# Altium schematic sheet 3_MCU.schdoc
size 711 x 327 mm; Name: A_A3; Symbol: A_A3; Device: A_A3; @Project Name: DM lite opensource board A2A V1.0; REV: 1.0; Date: 2022-03-15; Sheet: 1/1; Draw By: l87732382; Company: Your Company; Convert to PCB: yes; Add into BOM: yes
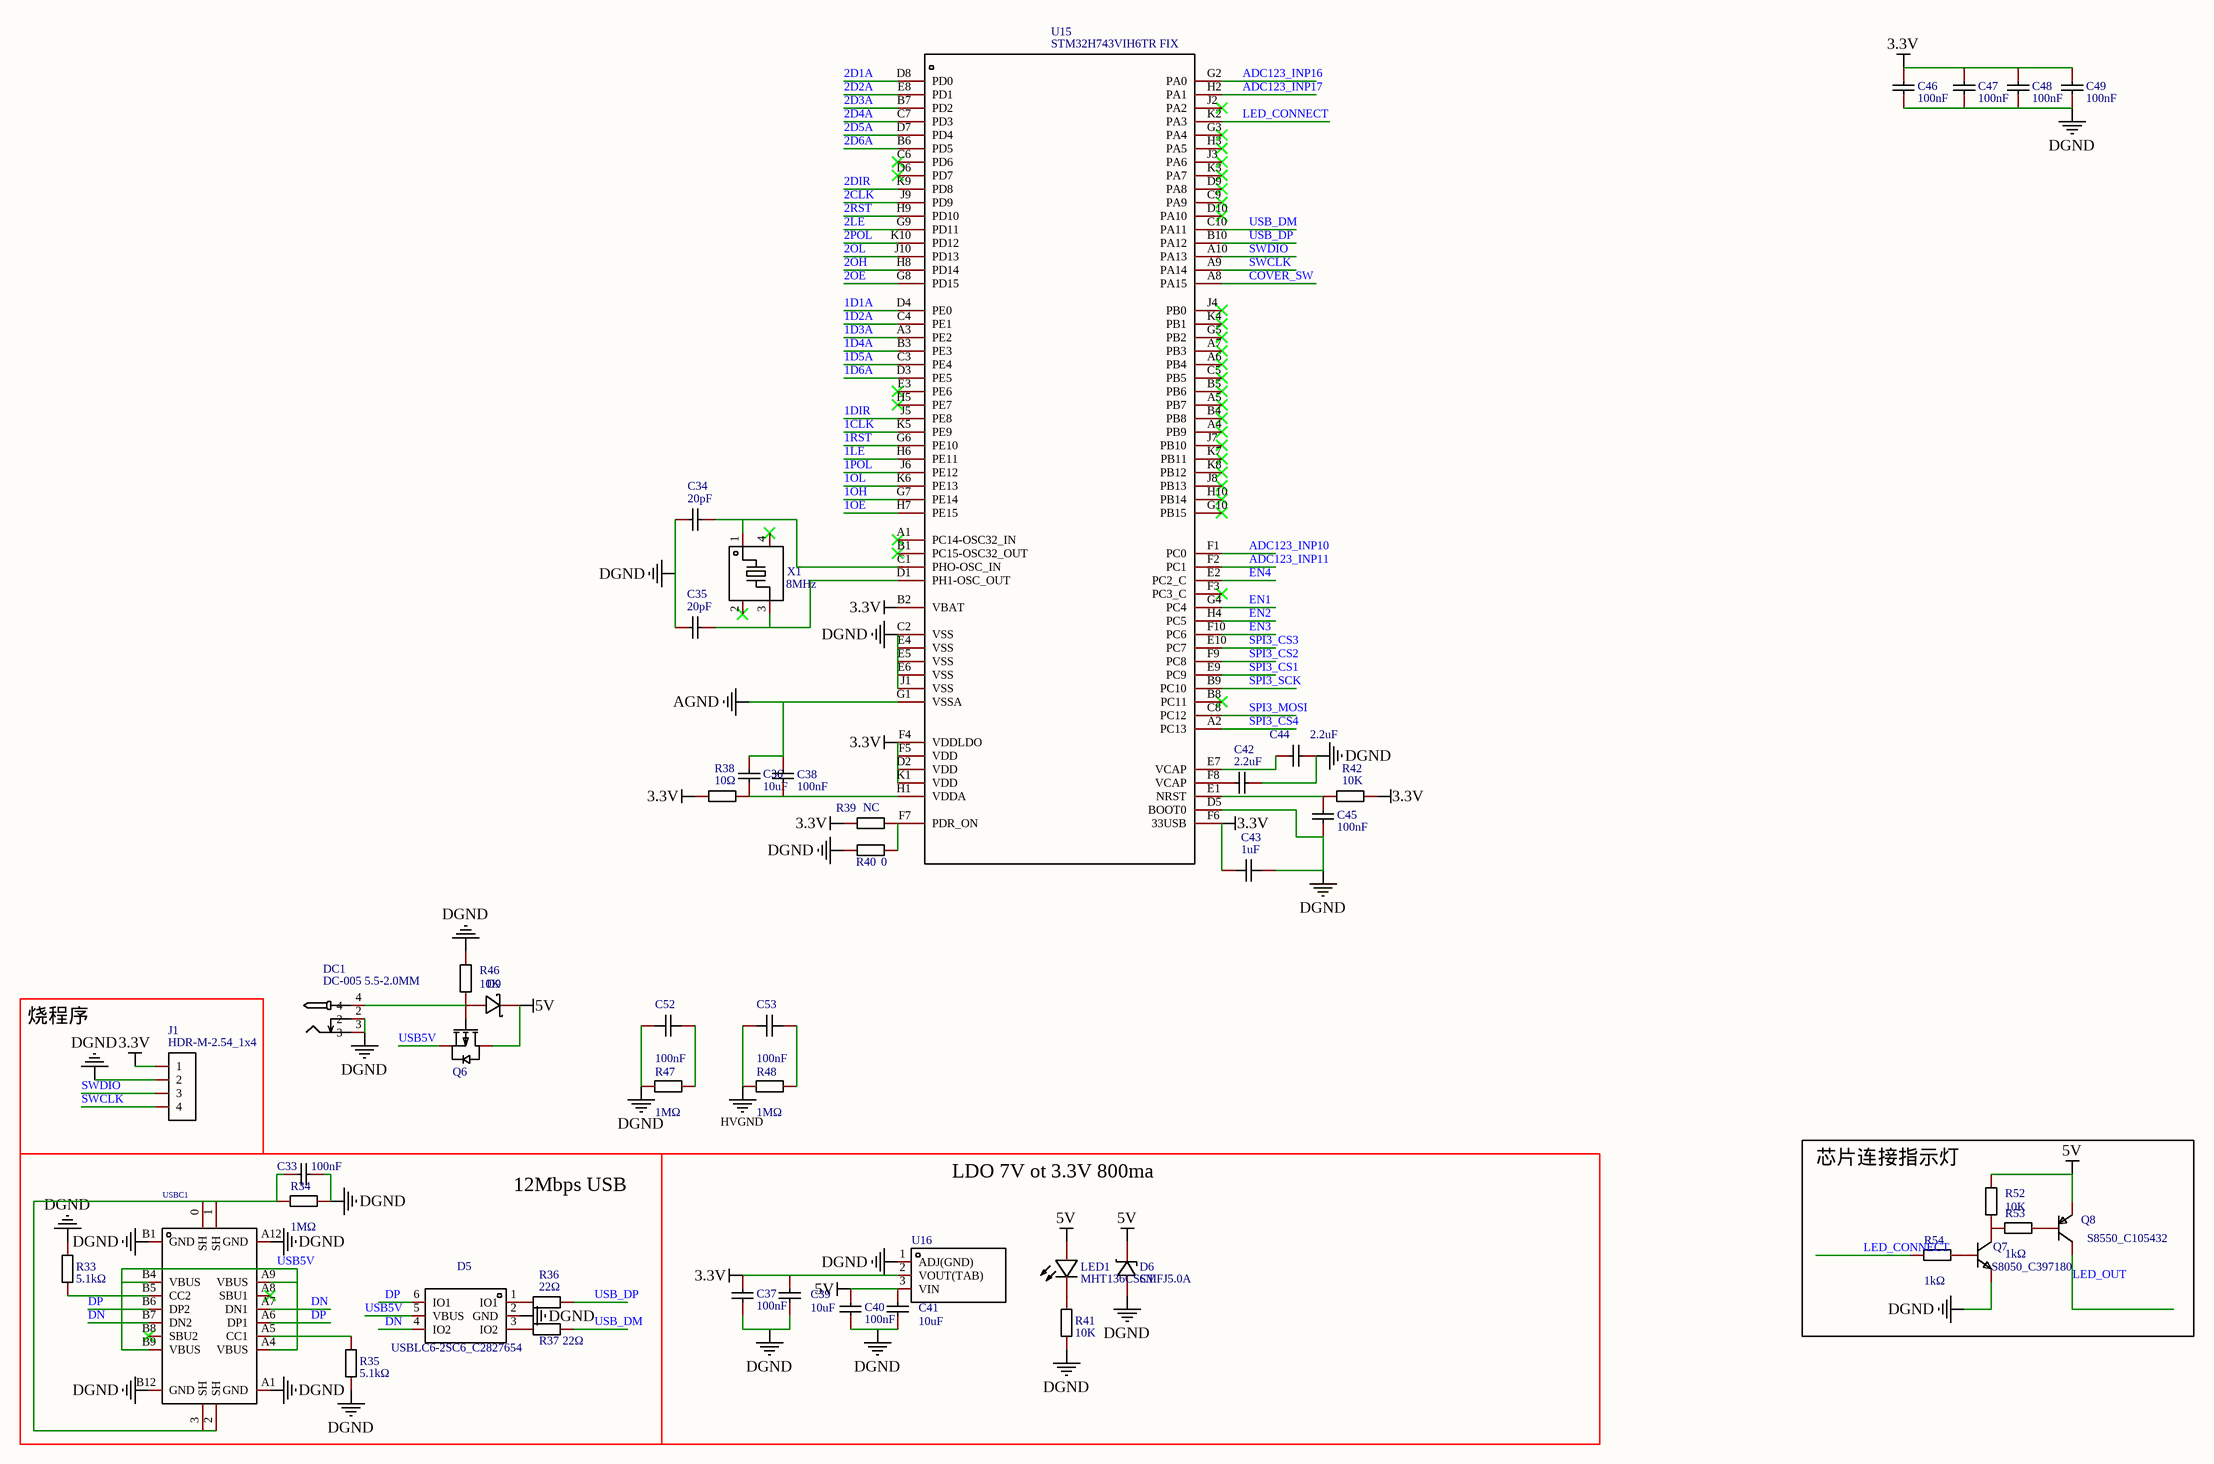
[diagram p0: 3_MCU.schdoc]

## Parts
C33  100nF  [C0402_NEW]
C34  20pF  [C0402]
C35  20pF  [C0402]
C36  10uF  [C0402]
C37  100nF  [C0402_NEW]
C38  100nF  [C0402_NEW]
C39  value 10uF  [C0402]  (hidden comment: CL05A106MQ5NUNC)
C40  100nF  [C0402_NEW]
C41  value 10uF  [C0402]  (hidden comment: CL05A106MQ5NUNC)
C42  2.2uF  [C0402]
C43  1uF  [C0402]
C44  2.2uF  [C0402]
C45  100nF  [C0402_NEW]
C46  100nF  [C0402_NEW]
C47  100nF  [C0402_NEW]
C48  100nF  [C0402_NEW]
C49  100nF  [C0402_NEW]
C52  value 100nF  [C0603]  (hidden comment: CC0603KRX7R9BB104)
C53  value 100nF  [C0603]  (hidden comment: CC0603KRX7R9BB104)
D5  USBLC6-2SC6_C2827654  [SOT-23-6_L2.9-W1.6-P0.95-LS2.8-BL]
D6  SMFJ5.0A  [SOD-123_L2.8-W1.8-LS3.7-RD]
D9  SS34_C8678  [SMA_L4.3-W2.6-LS5.2-RD]  (value not drawn)
DC1  DC-005 5.5-2.0MM  [DC-IN-TH_DC-5520-1]
J1  HDR-M-2.54_1x4  [HDR-M-2.54_1X4]
LED1  MHT136CSCT  [LED0402-RD_ORANGE]
Q6  CJ3401  [SOT-23-3_L2.9-W1.6-P1.90-LS2.8-BR]  (value not drawn)
Q7  S8050_C397180  [SOT-23_L2.9-W1.3-P1.90-LS2.4-BR]
Q8  S8550_C105432  [SOT-23-3_L2.9-W1.6-P1.90-LS2.8-BR]
R33  5.1kΩ  [R0402]
R34  value 1MΩ  [R0402]  (hidden comment: 0402WGF1004TCE)
R35  5.1kΩ  [R0402]
R36  22Ω  [R0402]
R37  22Ω  [R0402]
R38  10Ω  [R0402]
R39  NC  [R0402]
R40  0  [R0402]
R41  10K  [R0402]
R42  10K  [R0402]
R46  10K  [R0402]
R47  value 1MΩ  [R0603]  (hidden comment: 0603WAF1004T5E)
R48  value 1MΩ  [R0603]  (hidden comment: 0603WAF1004T5E)
R52  10K  [R0402]
R53  value 1kΩ  [R0402]  (hidden comment: 0402WGF1001TCE)
R54  value 1kΩ  [R0402]  (hidden comment: 0402WGF1001TCE)
U15  STM32H743VIH6TR FIX  [TFBGA-100_L8.0-W8.0-P0.80-R10-C10-TL-ST_DS]
U16  AMS1117-3.3_C347256  [SOT-89_L4.5-W2.5-P1.50-LS4.2-BR]  (value not drawn)
USBC1  TYPE-C-31-M-12  [USB-C_SMD-TYPE-C-31-M-12]  (value not drawn)
X1  8MHz  [CRYSTAL-SMD_4P-L3.2-W2.5-BL]

## Blocks framed on the sheet
烧程序: J1
12Mbps USB: C33 D5 R33-R37 USBC1
LDO 7V ot 3.3V 800ma: C37 C39-C41 D6 LED1 R41 U16
芯片连接指示灯: Q7 Q8 R52-R54

## Nets
3.3V: C37.2 C39.2 C43.2 C46.2 C47.2 C48.2 C49.2 J1.1 R38.1 R39.1 R42.2 U15.B2(VBAT) U15.D2(VDD) U15.F4(VDDLDO) U15.F5(VDD) U15.F6(33USB) U15.K1(VDD) U16.2(VOUT(TAB))
5V: C40.2 C41.2 D6.1(K) D9.1(K) LED1.2(A) Q6.3(D) Q8.2 R52.2 U16.3(VIN)
AGND: C36.2 C38.2 U15.G1(VSSA)
DGND: C33.1 C34.2 C35.2 C37.1 C39.1 C40.1 C41.1 C42.2 C43.1 C44.2 C45.1 C46.1 C47.1 C48.1 C49.1 C52.1 D5.2(GND) D6.2(A) DC1.2 DC1.3 J1.2 Q7.2(E) R33.2 R34.2 R35.1 R40.1 R41.1 R46.2 R47.1 U15.C2(VSS) U15.D5(BOOT0) U15.E4(VSS) U15.E5(VSS) U15.E6(VSS) U15.J1(VSS) U16.1(ADJ(GND)) USBC1.A1(GND) USBC1.A12(GND) USBC1.B1(GND) USBC1.B12(GND)
HVGND: C53.1 R48.1
1CLK: U15.K5(PE9)
1D1A: U15.D4(PE0)
1D2A: U15.C4(PE1)
1D3A: U15.A3(PE2)
1D4A: U15.B3(PE3)
1D5A: U15.C3(PE4)
1D6A: U15.D3(PE5)
1DIR: U15.J5(PE8)
1LE: U15.H6(PE11)
1OE: U15.H7(PE15)
1OH: U15.G7(PE14)
1OL: U15.K6(PE13)
1POL: U15.J6(PE12)
1RST: U15.G6(PE10)
2CLK: U15.J9(PD9)
2D1A: U15.D8(PD0)
2D2A: U15.E8(PD1)
2D3A: U15.B7(PD2)
2D4A: U15.C7(PD3)
2D5A: U15.D7(PD4)
2D6A: U15.B6(PD5)
2DIR: U15.K9(PD8)
2LE: U15.G9(PD11)
2OE: U15.G8(PD15)
2OH: U15.H8(PD14)
2OL: U15.J10(PD13)
2POL: U15.K10(PD12)
2RST: U15.H9(PD10)
ADC123_INP10: U15.F1(PC0)
ADC123_INP11: U15.F2(PC1)
ADC123_INP16: U15.G2(PA0)
ADC123_INP17: U15.H2(PA1)
COVER_SW: U15.A8(PA15)
DN: D5.4(IO2) USBC1.A7(DN1) USBC1.B7(DN2)
DP: D5.6(IO1) USBC1.A6(DP1) USBC1.B6(DP2)
EN1: U15.G4(PC4)
EN2: U15.H4(PC5)
EN3: U15.F10(PC6)
EN4: U15.E2(PC2_C)
LED_CONNECT: R54.1 U15.K2(PA3)
LED_OUT: Q8.3
SPI3_CS1: U15.E9(PC9)
SPI3_CS2: U15.F9(PC8)
SPI3_CS3: U15.E10(PC7)
SPI3_CS4: U15.A2(PC13)
SPI3_MOSI: U15.C8(PC12)
SPI3_SCK: U15.B9(PC10)
SWCLK: J1.4 U15.A9(PA14)
SWDIO: J1.3 U15.A10(PA13)
USB5V: D5.5(VBUS) Q6.2(S) USBC1.A4(VBUS) USBC1.A9(VBUS) USBC1.B4(VBUS) USBC1.B9(VBUS)
USB_DM: R37.2 U15.C10(PA11)
USB_DP: R36.2 U15.B10(PA12)
NetC33_2: C33.2 R34.1 USBC1.0(SH) USBC1.1(SH) USBC1.2(SH) USBC1.3(SH)
NetC34_1: C34.1 U15.C1(PHO-OSC_IN) X1.1
NetC35_1: C35.1 U15.D1(PH1-OSC_OUT) X1.3
NetC36_1: C36.1 C38.1 R38.2 U15.H1(VDDA)
NetC42_1: C42.1 U15.F8(VCAP)
NetC44_1: C44.1 U15.E7(VCAP)
NetC45_2: C45.2 R42.1 U15.E1(NRST)
NetC52_2: C52.2 R47.2
NetC53_2: C53.2 R48.2
NetD5_1: D5.1(IO1) R36.1
NetD5_3: D5.3(IO2) R37.1
NetD9_2: D9.2(A) DC1.4 Q6.1(G) R46.1
NetLED1_1: LED1.1(K) R41.2
NetQ7_1: Q7.1(B) R54.2
NetQ7_3: Q7.3(C) R52.1 R53.1
NetQ8_1: Q8.1 R53.2
NetR33_1: R33.1 USBC1.B5(CC2)
NetR35_2: R35.2 USBC1.A5(CC1)
NetR39_2: R39.2 R40.2 U15.F7(PDR_ON)

Not connected (* = marked no-connect by the designer): U15 A1(PC14-OSC32_IN)* A4(PB9)* A5(PB7)* A6(PB4)* A7(PB3)* B1(PC15-OSC32_OUT)* B4(PB8)* B5(PB6)* B8(PC11)* C5(PB5)* C6(PD6)* C9(PA9)* D6(PD7)* D9(PA8)* D10(PA10)* E3(PE6)* F3(PC3_C)* G3(PA4)* G5(PB2)* G10(PB15)* H3(PA5)* H5(PE7)* H10(PB14)* J2(PA2)* J3(PA6)* J4(PB0)* J7(PB10)* J8(PB13)* K3(PA7)* K4(PB1)* K7(PB11)* K8(PB12)*; USBC1 A8(SBU1)* B8(SBU2)*; X1 2(GND)* 4(GND)*

## Notes on the sheet
- 1
- 2
- 3
- 4
- 5
- 6
- 7
- 8
- A
- B
- C
- D
- E
- TITLE:
- DM lite opensource board A2A V1.0
- REV:
- 1.0
- Date:
- Company:
- 2022-03-15
- Your Company
- Drawn By:
- l87732382
- Sheet:
- 1/1

## Library data of the parts
C33 C37 C38 C40 C45-C49 = CL05B104KO5NNNC: Manufacturer: SAMSUNG; Convert to PCB: yes; Name: 100nF; Symbol: 100nF; Device: CL05B104KO5NNNC; Supplier: LCSC; Manufacturer Part: CL05B104KO5NNNC; Supplier Part: C1525; JLCPCB Part Class: Basic Part; Add into BOM: yes; Origin Footprint: C0402_NEW
C34 C35 = 0402CG200J500NT: Manufacturer: FH; Convert to PCB: yes; Name: 20pF; Symbol: 20pF; Device: 0402CG200J500NT; Supplier: LCSC; Manufacturer Part: 0402CG200J500NT; Supplier Part: C1554; JLCPCB Part Class: Basic Part; Add into BOM: yes; Origin Footprint: C0402
C36 = CL05A106MQ5NUNC: Manufacturer: SAMSUNG; Convert to PCB: yes; Name: 10uF; Symbol: 10uF; Device: CL05A106MQ5NUNC; Supplier: LCSC; Manufacturer Part: CL05A106MQ5NUNC; Supplier Part: C15525; JLCPCB Part Class: Basic Part; Add into BOM: yes; Origin Footprint: C0402
C39 C41 = CL05A106MQ5NUNC: 容值:10uF;精度:±20%;额定电压:6.3V;材质(温度系数):X5R;; Manufacturer: SAMSUNG(三星); Add into BOM: yes; Tolerance: ±20%; Voltage Rated: 6.3V; Temperature Coefficient: X5R; Name: 10uF; Symbol: CL05A106MQ5NUNC; Device: CL05A106MQ5NUNC; LCSC Part Name: 10uF ±20% 6.3V; Supplier Part: C15525; Manufacturer Part: CL05A106MQ5NUNC; Supplier Footprint: 0402; JLCPCB Part Class: 基础库; Datasheet: https://atta.szlcsc.com/upload/public/pdf/source/20220823/2B02EE04F8F211D38A52DCB16EB6BEBA.pdf; Supplier: LCSC; Convert to PCB: yes
C42 C44 = GRM155R61A225KE95D: Manufacturer: MuRata; Convert to PCB: yes; Name: 2.2uF; Symbol: 2.2uF; Device: GRM155R61A225KE95D; Supplier: LCSC; Manufacturer Part: GRM155R61A225KE95D; Supplier Part: C77002; JLCPCB Part Class: Extended Part; Add into BOM: yes; Origin Footprint: C0402
C43 = CL05A105KA5NQNC: Manufacturer: SAMSUNG; Convert to PCB: yes; Name: 1uF; Symbol: 1uF; Device: CL05A105KA5NQNC; Supplier: LCSC; Manufacturer Part: CL05A105KA5NQNC; Supplier Part: C52923; JLCPCB Part Class: Basic Part; Add into BOM: yes; Origin Footprint: C0402
C52 C53 = CC0603KRX7R9BB104: 容值:100nF;精度:±10%;额定电压:50V;材质(温度系数):X7R;; Manufacturer: YAGEO(国巨); Add into BOM: yes; Tolerance: ±10%; Voltage Rated: 50V; Temperature Coefficient: X7R; Name: 100nF; Symbol: CC0603KRX7R9BB104; Device: CC0603KRX7R9BB104; LCSC Part Name: 100nF ±10% 50V; Supplier Part: C14663; Manufacturer Part: CC0603KRX7R9BB104; Supplier Footprint: 0603; JLCPCB Part Class: 基础库; Datasheet: https://atta.szlcsc.com/upload/public/pdf/source/20180910/C282072_33301C7F631E79921B82A8DAC6BCC5B3.pdf; Supplier: LCSC; Convert to PCB: yes
D5 = USBLC6-2SC6: Manufacturer: TECH PUBLIC(台舟电子); Convert to PCB: yes; Name: USBLC6-2SC6_C2827654; Symbol: USBLC6-2SC6_C2827654; Device: USBLC6-2SC6; Supplier: LCSC; Supplier Part: C2827654; Manufacturer Part: USBLC6-2SC6; Add into BOM: yes; Origin Footprint: SOT-23-6_L2.9-W1.6-P0.95-LS2.8-BL
D6 = SMFJ5.0A: Manufacturer: RUILON; Convert to PCB: yes; Name: SMFJ5.0A; Symbol: SMFJ5.0A; Device: SMFJ5.0A; Supplier: LCSC; Manufacturer Part: SMFJ5.0A; Supplier Part: C61216; JLCPCB Part Class: Extended Part; Add into BOM: yes; Origin Footprint: SOD-123_L2.8-W1.8-LS3.7-RD
D9 = SS34_C8678: 二极管配置:独立式;直流反向耐压(Vr):40V;平均整流电流(Io):3A;正向压降(Vf):550mV@3A;; Manufacturer: MDD; Name: SS34; Add into BOM: yes; Diode Configuration: 独立式; Reverse Voltage (Vr): 40V; Average Rectified Current (Io): 3A; Reverse Leakage Current (Ir): 500uA@40V; Symbol: SS34_C8678; Device: SS34_C8678; LCSC Part Name: 40V 3A 550mV@3A; Supplier Part: C8678; Manufacturer Part: SS34; Supplier Footprint: SMA(DO-214AC); JLCPCB Part Class: 基础库; Datasheet: https://atta.szlcsc.com/upload/public/pdf/source/20230314/A80AE34493C69B89E2F4B1712F433538.pdf; Supplier: LCSC; Convert to PCB: yes; Forward Voltage (Vf@If): 550mV@3A
DC1 = DC-005 5.5-2.0MM: Manufacturer: BOOMELE; Convert to PCB: yes; Name: DC-005 5.5-2.0MM; Symbol: DC-005 5.5-2.0MM; Device: DC-005 5.5-2.0MM; Supplier: LCSC; Manufacturer Part: DC-005 5.5-2.0MM; Supplier Part: C16214; JLCPCB Part Class: Extended Part; Add into BOM: yes; Origin Footprint: DC-IN-TH_DC-5520-1
J1 = HDR-M-2.54_1x4: Convert to PCB: yes; Name: HDR-M-2.54_1x4; Symbol: HDR-M-2.54_1x4; Device: HDR-M-2.54_1x4; Supplier Part: C124378; Supplier: LCSC; Add into BOM: yes; Origin Footprint: HDR-M-2.54_1X4
LED1 = MHT136CSCT: Manufacturer: MEIHUA; Convert to PCB: yes; Name: MHT136CSCT; Symbol: MHT136CSCT; Device: MHT136CSCT; Supplier: LCSC; Supplier Part: C401113; Manufacturer Part: MHT136CSCT; JLCPCB Part Class: Extended Part; Add into BOM: yes; Origin Footprint: LED0402-RD_ORANGE
Q6 = CJ3401: 类型:P沟道;漏源电压(Vdss):30V;连续漏极电流(Id):4.2A;功率(Pd):350mW;导通电阻(RDS(on)@Vgs,Id):65mΩ@10V,4.2A;; Manufacturer: CJ(江苏长电/长晶); Add into BOM: yes; Type: P沟道; Drain Source Voltage (Vdss): 30V; Power Dissipation (Pd): 350mW; Gate Threshold Voltage (Vgs(th)@Id): 1.3V@250uA; Name: CJ3401; Symbol: CJ3401; Device: CJ3401; LCSC Part Name: P沟道 30V 4.2A; Supplier Part: C13799; Manufacturer Part: CJ3401; Supplier Footprint: SOT-23; JLCPCB Part Class: 扩展库; Datasheet: https://atta.szlcsc.com/upload/public/pdf/source/20140815/1457707217656.pdf; Supplier: LCSC; Convert to PCB: yes; Continuous Drain Current (Id): 4.2A; Drain Source On Resistance (RDS(on)@Vgs,Id): 65mΩ@10V,4.2A
Q7 = S8050_C397180: Manufacturer: AnBon; Manufacturer Part: S8050; Paste Type: recommend; Convert to PCB: yes; Name: S8050_C397180; Symbol: S8050_C397180; Device: S8050_C397180; Supplier: LCSC; Supplier Part: C397180; Assembly Type: smtWeld; Add into BOM: yes; Origin Footprint: SOT-23_L2.9-W1.3-P1.90-LS2.4-BR
Q8 = S8550_C105432: Manufacturer: CJ; Manufacturer Part: S8550; Paste Type: recommend; Convert to PCB: yes; Name: S8550_C105432; Symbol: S8550_C105432; Device: S8550_C105432; Supplier: LCSC; Supplier Part: C105432; Assembly Type: smtWeld; Add into BOM: yes; Origin Footprint: SOT-23-3_L2.9-W1.6-P1.90-LS2.8-BR
R33 R35 = 0402WGF5101TCE: Manufacturer: UniOhm; Resistance: 5.1K; Convert to PCB: yes; Name: 5.1kΩ; Symbol: 5.1kΩ; Device: 0402WGF5101TCE; Supplier: LCSC; Manufacturer Part: 0402WGF5101TCE; Supplier Part: C25905; JLCPCB Part Class: Basic Part; Add into BOM: yes; Origin Footprint: R0402
R34 = 0402WGF1004TCE: 电阻类型:厚膜电阻;阻值:1MΩ;精度:±1%;功率:62.5mW;; Manufacturer: UNI-ROYAL(厚声); Add into BOM: yes; Tolerance: ±1%; Power(Watts): 62.5mW; Temperature Coefficient: ±100ppm/℃; Overload Voltage (Max): 50V; Name: 1MΩ; Symbol: 0402WGF1004TCE; Device: 0402WGF1004TCE; LCSC Part Name: 1MΩ ±1% 62.5mW; Supplier Part: C26083; Manufacturer Part: 0402WGF1004TCE; Supplier Footprint: 0402; JLCPCB Part Class: 基础库; Datasheet: https://atta.szlcsc.com/upload/public/pdf/source/20200306/C422600_1E6D84923E4A46A82E41ADD87F860B5C.pdf; Supplier: LCSC; Convert to PCB: yes; Type: 厚膜电阻; Operating Temperature Range: -55℃~+155℃
R36 R37 = 0402WGF220JTCE: Manufacturer: UniOhm; Resistance: 22; Convert to PCB: yes; Name: 22Ω; Symbol: 22Ω; Device: 0402WGF220JTCE; Supplier: LCSC; Manufacturer Part: 0402WGF220JTCE; Supplier Part: C25092; JLCPCB Part Class: Basic Part; Add into BOM: yes; Origin Footprint: R0402
R38 = 0402WGF100JTCE: Manufacturer: UniOhm; Symbol: 0; Resistance: 10; Convert to PCB: yes; Name: 10Ω; Device: 0402WGF100JTCE; Supplier: LCSC; Manufacturer Part: 0402WGF100JTCE; Supplier Part: C25077; JLCPCB Part Class: Basic Part; Add into BOM: yes; Origin Footprint: R0402
R39 = NC: Manufacturer: UniOhm; Resistance: 0; Convert to PCB: yes; Name: NC; Symbol: NC; Device: NC; Supplier: LCSC; JLCPCB Part Class: Basic Part; Add into BOM: yes; Origin Footprint: R0402
R40 = 0402WGF100JTCE: Manufacturer: UniOhm; Convert to PCB: yes; Name: 0; Symbol: 0; Device: 0402WGF100JTCE; Supplier: LCSC; Manufacturer Part: 0402WGF100JTCE; Resistance: 0; JLCPCB Part Class: Basic Part; Add into BOM: yes; Origin Footprint: R0402
R41 R42 R46 R52 = 0402WGF1002TCE: Manufacturer: UniOhm; Convert to PCB: yes; Name: 10K; Symbol: 10K; Device: 0402WGF1002TCE; Supplier: LCSC; Manufacturer Part: 0402WGF1002TCE; Supplier Part: C25744; JLCPCB Part Class: Basic Part; Add into BOM: yes; Origin Footprint: R0402
R47 R48 = 0603WAF1004T5E: 电阻类型:厚膜电阻;阻值:1MΩ;精度:±1%;功率:100mW;; Manufacturer: UNI-ROYAL(厚声); Add into BOM: yes; Tolerance: ±1%; Power(Watts): 100mW; Temperature Coefficient: ±100ppm/℃; Overload Voltage (Max): 75V; Name: 1MΩ; Symbol: 0603WAF1004T5E; Device: 0603WAF1004T5E; LCSC Part Name: 1MΩ ±1% 100mW; Supplier Part: C22935; Manufacturer Part: 0603WAF1004T5E; Supplier Footprint: 0603; JLCPCB Part Class: 基础库; Datasheet: https://atta.szlcsc.com/upload/public/pdf/source/20200306/C422600_1E6D84923E4A46A82E41ADD87F860B5C.pdf; Supplier: LCSC; Convert to PCB: yes; Type: 厚膜电阻; Operating Temperature Range: -55℃~+155℃
R53 R54 = 0402WGF1001TCE: 电阻类型:厚膜电阻;阻值:1kΩ;精度:±1%;功率:62.5mW;; Manufacturer: UNI-ROYAL(厚声); Add into BOM: yes; Tolerance: ±1%; Power(Watts): 62.5mW; Temperature Coefficient: ±100ppm/℃; Overload Voltage (Max): 50V; Name: 1kΩ; Symbol: 0402WGF1001TCE; Device: 0402WGF1001TCE; LCSC Part Name: 1kΩ ±1% 62.5mW; Supplier Part: C11702; Manufacturer Part: 0402WGF1001TCE; Supplier Footprint: 0402; JLCPCB Part Class: 基础库; Datasheet: https://atta.szlcsc.com/upload/public/pdf/source/20200306/C422600_1E6D84923E4A46A82E41ADD87F860B5C.pdf; Supplier: LCSC; Convert to PCB: yes; Type: 厚膜电阻; Operating Temperature Range: -55℃~+155℃
U15 = STM32H743VIH6TR: Manufacturer: ST(意法半导体); Convert to PCB: yes; Name: STM32H743VIH6TR FIX; Symbol: STM32H743VIH6TR FIX; Device: STM32H743VIH6TR; Supplier: LCSC; Supplier Part: C1857444; Manufacturer Part: STM32H743VIH6TR; JLCPCB Part Class: Extended Part; Add into BOM: yes; Origin Footprint: TFBGA-100_L8.0-W8.0-P0.80-R10-C10-TL-ST_DS
U16 = AMS1117-3.3_C347256: 输出类型:固定;输出极性:正;最大输入电压:18V;输出电压:3.3V;输出电流:1A;电源纹波抑制比(PSRR):60dB@(120Hz);; Manufacturer: UMW(广东友台半导体); Add into BOM: yes; Output Type: 固定; Output Polarity: 正; Number of Outputs: 1; Maximum Input Voltage: 18V; Output Voltage: 3.3V; Dropout Voltage: 1.3V@(1A); Output Current: 1A; Name: AMS1117-3.3; Symbol: AMS1117-3.3_C347256; Device: AMS1117-3.3_C347256; LCSC Part Name: 输入18V 输出3.3V 1A; Supplier Part: C347256; Manufacturer Part: AMS1117-3.3; Supplier Footprint: SOT-89; JLCPCB Part Class: 扩展库; Datasheet: https://atta.szlcsc.com/upload/public/pdf/source/20211011/50CC665C22E3A66C08379A4A74BDA25C.pdf; Supplier: LCSC; Convert to PCB: yes; Power Supply Rejection Ratio (PSRR): 60dB@(120Hz)
USBC1 = TYPE-C-31-M-12: 连接器类型:Type-C;标准:-;公母:母座;触点数量:16P;端口数量:1;安装方式:-;额定电流 - 电源:5A;触头材质:-;触头镀层:-;工作温度范围:-;焊接温度(最大值):-;; Manufacturer: 韩国韩荣; Add into BOM: yes; Connector Type: Type-C; Gender: 母座; Number of Contacts: 16P; Number of Ports: 1; Current Rating - Power (Max): 5A; Name: TYPE-C-31-M-12; Symbol: TYPE-C-31-M-12; Device: TYPE-C-31-M-12; LCSC Part Name: Type-C 母座; Supplier Part: C165948; Manufacturer Part: TYPE-C-31-M-12; Supplier Footprint: SMD; JLCPCB Part Class: 扩展库; Datasheet: https://atta.szlcsc.com/upload/public/pdf/source/20220525/466408E853115E789EDB0DDC29077C05.pdf; Supplier: LCSC; Convert to PCB: yes; Standard: -; Mounting Style: -; Contact Material: -; Contact Plating: -; Operating Temperature Range: -; Welding Temperature (Max): -
X1 = 3225-8.00-20-10-10/A: Manufacturer: Suzhou Liming Elec; Convert to PCB: yes; Name: 8MHz; Symbol: 8MHz; Device: 3225-8.00-20-10-10/A; Supplier: LCSC; Supplier Part: C518156; Manufacturer Part: 3225-8.00-20-10-10/A; JLCPCB Part Class: Extended Part; Add into BOM: yes; Origin Footprint: CRYSTAL-SMD_4P-L3.2-W2.5-BL